# Altium project SPARTAN MINI HW2.0.PrjPcb
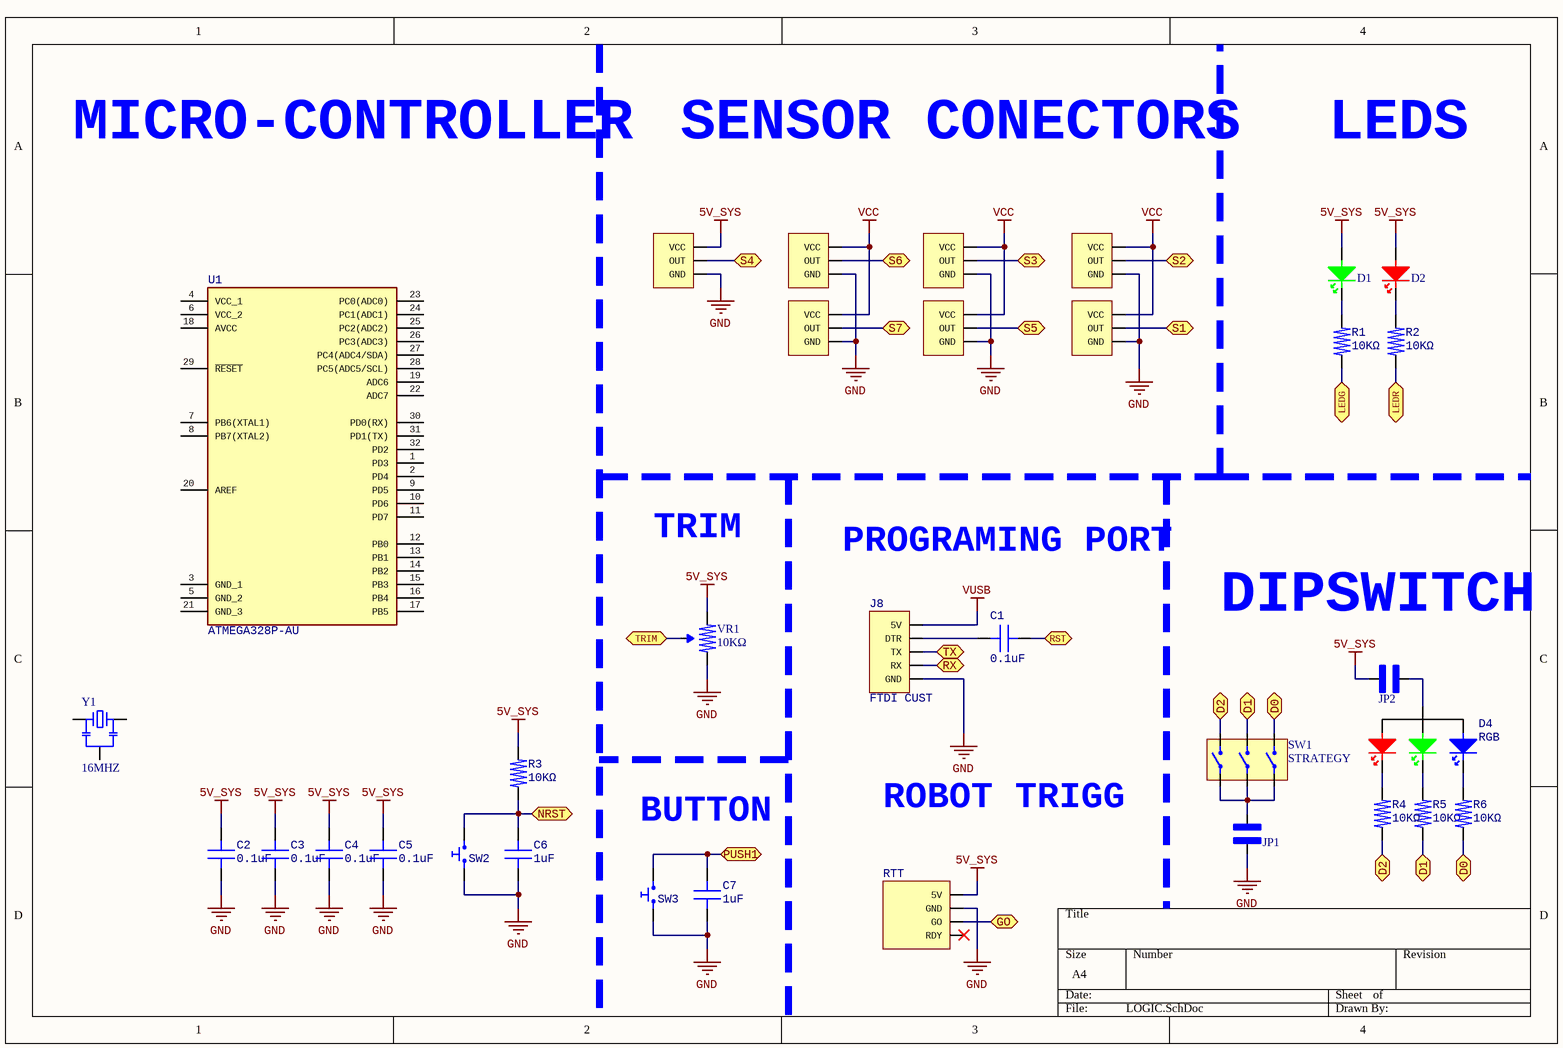
[diagram p0: LOGIC.SchDoc]
2 sheets, 77 parts. Net scope: flat (ports and power ports of the same name join across sheets).
Board file: SPARTAN MINI HW2.0 PCB.PcbDoc
Sheets:
  LOGIC.SchDoc
  POWER.SchDoc

## Sheet LOGIC.SchDoc
size A4; SheetNumber: 1; SheetTotal: 2

### Parts
C1  0.1uF  [CAP0603]
C2  0.1uF  [CAP0603]
C3  0.1uF  [CAP0603]
C4  0.1uF  [CAP0603]
C5  0.1uF  [CAP0603]
C6  1uF  [CAP0603]
C7  1uF  [CAP0603]
D1  G  [LED0603 GREEN]  (value not drawn)
D2  R  [LED0603 RED]  (value not drawn)
D4  RGB  [LED RGB FM-B2020RGBA-HG]
J1  GENERIC SENSOR 3X  [PINHEADER SENSOR CONNECTOR 3X]  (value not drawn)
J2  GENERIC SENSOR 3X  [PINHEADER SENSOR CONNECTOR 3X]  (value not drawn)
J3  GENERIC SENSOR 3X  [PINHEADER SENSOR CONNECTOR 3X]  (value not drawn)
J4  GENERIC SENSOR 3X  [PINHEADER SENSOR CONNECTOR 3X]  (value not drawn)
J5  GENERIC SENSOR 3X  [PINHEADER SENSOR CONNECTOR 3X]  (value not drawn)
J6  GENERIC SENSOR 3X  [PINHEADER SENSOR CONNECTOR 3X]  (value not drawn)
J7  GENERIC SENSOR 3X  [PINHEADER SENSOR CONNECTOR 3X]  (value not drawn)
J8  FTDI CUST  [UART PROG CONN]
J9  RTT  [ING. MAKER RTT]
JP1  ENABLE DPSW  [JUMPER 2 PADS]  (value not drawn)
JP2  ENABLE RGB  [JUMPER 2 PADS]  (value not drawn)
R1  10KΩ  [RES0603]
R2  10KΩ  [RES0603]
R3  10KΩ  [RES0603]
R4  10KΩ  [RES0603]
R5  10KΩ  [RES0603]
R6  10KΩ  [RES0603]
SW1  STRATEGY  [2193MSTR]
SW2  RESET  [PTS810SJK250SMTRLFS]  (value not drawn)
SW3  BUTTON1  [PTS810SJK250SMTRLFS]  (value not drawn)
U1  ATMEGA328P-AU  [TQFP-32]
VR1  10KΩ  [TC33X2503E]
Y1  16MHZ  [CSTCE16M0V53R0]

### Ports
D0 (bidir), D1 (bidir), D2 (bidir), GO (bidir), LEDG (bidir), LEDR (bidir), NRST (bidir), PUSH1 (bidir), RST (bidir), RX (bidir), S1 (bidir), S2 (bidir), S3 (bidir), S4 (bidir), S5 (bidir), S6 (bidir), S7 (bidir), TRIM (bidir), TX (bidir)

### Nets
5V_SYS: C2.2(A) C3.2(A) C4.2(A) C5.2(A) D1.2(A) D2.2(A) J1.2(VCC) J9.1(5V) JP2.C R3.2(A) VR1.3(CW)
GND: C2.1(K) C3.1(K) C4.1(K) C5.1(K) C6.1(K) C7.1(K) J1.4(GND) J2.4(GND) J3.4(GND) J4.4(GND) J5.4(GND) J6.4(GND) J7.4(GND) J8.GND J9.2(GND) JP1.C SW2.1(NO_1) SW3.1(NO_1) VR1.1(CCW)
VCC: J2.2(VCC) J3.2(VCC) J4.2(VCC) J5.2(VCC) J6.2(VCC) J7.2(VCC)
VUSB: J8.5V
NetC1_1: C1.1(K) ; port RST
NetC1_2: C1.2(A) J8.DTR
NetC6_2: C6.2(A) R3.1(K) SW2.2(NO_2) ; port NRST
NetC7_2: C7.2(A) SW3.2(NO_2) ; port PUSH1
NetD1_1: D1.1(K) R1.2(A)
NetD2_1: D2.1(K) R2.2(A)
NetD4_1: D4.1(K) R4.2(A)
NetD4_2: D4.2(K) R6.2(A)
NetD4_3: D4.3(COM) JP2.A
NetD4_4: D4.4(K) R5.2(A)
NetJ1_3: J1.3(OUT) ; port S4
NetJ2_3: J2.3(OUT) ; port S6
NetJ3_3: J3.3(OUT) ; port S2
NetJ4_3: J4.3(OUT) ; port S1
NetJ5_3: J5.3(OUT) ; port S5
NetJ6_3: J6.3(OUT) ; port S7
NetJ7_3: J7.3(OUT) ; port S3
NetJ8_RX: J8.RX ; port RX
NetJ8_TX: J8.TX ; port TX
NetJ9_3: J9.3(GO) ; port GO
NetJP1_A: JP1.A SW1.1(NO_1) SW1.2(NO_1) SW1.3(NO_1)
NetR1_1: R1.1(K) ; port LEDG
NetR2_1: R2.1(K) ; port LEDR
NetR4_1: R4.1(K) SW1.6(NO_2) ; port D2
NetR5_1: R5.1(K) SW1.5(NO_2) ; port D1
NetR6_1: R6.1(K) SW1.4(NO_2) ; port D0
NetVR1_2: VR1.2(WIPER) ; port TRIM

Not connected (* = marked no-connect by the designer): J9 4(RDY)*; U1 1(PD3) 2(PD4) 3(GND_1) 4(VCC_1) 5(GND_2) 6(VCC_2) 7(PB6(XTAL1)) 8(PB7(XTAL2)) 9(PD5) 10(PD6) 11(PD7) 12(PB0) 13(PB1) 14(PB2) 15(PB3) 16(PB4) 17(PB5) 18(AVCC) 19(ADC6) 20(AREF) 21(GND_3) 22(ADC7) 23(PC0(ADC0)) 24(PC1(ADC1)) 25(PC2(ADC2)) 26(PC3(ADC3)) 27(PC4(ADC4/SDA)) 28(PC5(ADC5/SCL)) 29(~{RESET}) 30(PD0(RX)) 31(PD1(TX)) 32(PD2); Y1 1 3 4

### Notes on the sheet
- MICRO-CONTROLLER
- SENSOR CONECTORS
- LEDS
- TRIM
- PROGRAMING PORT
- DIPSWITCH
- BUTTON
- ROBOT TRIGG

### Library data of the parts
C1-C5 = C0.1uF 25V X7R: Capacitor, Multilayer, Ceramic, 25V, 10%, X7R, 15% Tc, 0.1Uf, Surface Mount, 0603; Manufacturer: KEMET; Manufacturer Part Number: C0603C104K3RACTU; Material: 4241ConductorMaterial; Capacitance: 100nF; Dissipation Factor: 3.5%; Temperature Coefficient: 30ppm/°C; Supplier 1: Mouser; RoHS: Yes; Category: Ceramic Capacitors; Stock 1: 364631; Pricing 1: 1=0.19, 10=0.12, 50=0.12, 100=0.062, 1000=0.041, 10000=0.024 (USD); Mount: Surface Mount,PCB; Case/Package: 0603; Number of Pins: 2; Case Code (Metric): 1608; Case Code (Imperial): 0603; Dielectric Material: Ceramic; Min Operating Temperature: -55°C; Max Operating Temperature: 125°C; Dielectric: X7R; Package Quantity: 1; Voltage Rating: 25V; Tolerance: 10%; Packaging: Tape and Reel; Voltage Rating (DC): 25V; Termination: SMD/SMT; Voltage: 25V; Series: C; Construction: Flat; Length: 1.6mm; Width: 0.031inch; Height: 0.8mm; Thickness: 0.034inch; Lead Pitch: 0.7mm; Depth: 0.8mm; Radiation Hardening: No; Reach SVHC Compliant: No; RoHS Compliant: Yes; Lead Free: 5697LeadFree
C6 C7 = C1uF 50V X5R: Multilayer Ceramic Capacitor, 1 uF, 50 V, ï¿½ 10%, X5R, 0603 [1608 Metric]; Manufacturer: TDK; Manufacturer Part Number: C1608X5R1H105K080AB; Dielectric Material: 4241ConductorMaterial; Voltage Rating: 50V; Supplier 1: Mouser; RoHS: Yes; Category: Ceramic Capacitors; Stock 1: 142150; Pricing 1: 1=0.14, 10=0.078, 50=0.078, 100=0.05, 1000=0.035, 10000=0.023 (USD); Mount: Surface Mount; Case/Package: 0603; Number of Pins: 2; Case Code (Metric): 1608; Case Code (Imperial): 0603; Material: Ceramic; Min Operating Temperature: -55°C; Max Operating Temperature: 85°C; Capacitance: 1uF; Tolerance: 10%; Packaging: Tape and Reel; Package Quantity: 1; Dielectric: X5R; Voltage: 50V; Series: C; Construction: Flat; Length: 1.6mm; Width: 0.031inch; Height: 0.8mm; Thickness: 0.035inch; Depth: 0.8mm; Reach SVHC Compliant: No; Lead Free: Lead Free; RoHS Compliant: Yes
D1 = GREEN LED 0603: WURTH ELEKTRONIK - 150060VS75000 - LED, Green, SMD, 0603, 30 mA, 2 V, 570 nm; Manufacturer: Wurth Electronics; Lens Color: Colorless; Luminous Intensity: 40mcd; Viewing Angle: 140°; Forward Voltage: 2V; Lens Style: Rectangular,Flat; Forward Current: 20mA; Dominant Wavelength: 570nm; Lens Transparency: Clear; Power Rating: 72mW; Reverse Voltage (DC): 5V; Lens Size: 0.7mm; Supplier 1: Mouser; Manufacturer Part Number: 150060VS75000; RoHS: Yes; Category: LEDs; Stock 1: 15118; Pricing 1: 1=0.14, 10=0.14, 50=0.127, 100=0.109, 1000=0.101, 10000=0.101 (USD); Mount: Surface Mount; Case/Package: 0603; Number of Pins: 2; Color: Green; Case Code (Metric): 1608; Case Code (Imperial): 0603; Weight: 0.000882oz; Min Operating Temperature: -40°C; Max Operating Temperature: 85°C; Package Quantity: 4000; Packaging: Cut Tape; Test Current: 20mA; Illumination Color: Green; Series: WL-SMCW; Max Reverse Voltage (DC): 5V; Power Dissipation: 72mW; Reverse Voltage: 5V; Length: 1.6mm; Width: 0.8mm; Height: 0.8mm; RoHS Compliant: Yes; Reach SVHC Compliant: Unknown
D2 = RED LED 0603: Led, Red, 630 Nm, 1.9 V, 30 Ma, 60 Mcd Rohs Compliant: Yes |Wurth Elektronik 150060SS75000; Manufacturer: Wurth Electronics; Lens Color: Colorless; Luminous Intensity: 60mcd; Viewing Angle: 140°; Forward Voltage: 1.9V; Wavelength: 630nm; Lens Style: Clear,Flat,Rectangular; Forward Current: 30mA; Test Current: 20mA; Lens Transparency: Clear; Max Reverse Voltage (DC): 5V; Lens Size: 0.7mm; Supplier 1: Mouser; Manufacturer Part Number: 150060SS75000; RoHS: Yes; Category: LEDs; Stock 1: 8814; Pricing 1: 1=0.15, 10=0.15, 50=0.142, 100=0.122, 1000=0.116, 10000=0.116 (USD); Mount: Surface Mount; Case/Package: 0603; Color: Red; Case Code (Metric): 1608; Case Code (Imperial): 0603; Min Operating Temperature: -40°C; Max Operating Temperature: 85°C; Package Quantity: 1; Packaging: Cut Tape; Dominant Wavelength: 630nm; Series: WL-SMCW; Length: 1.6mm; Width: 0.8mm; Height: 0.8mm; RoHS Compliant: Yes; Reach SVHC Compliant: Unknown
D4 = RGB LED FM-B2020RGBA-HG: LED RGB
J1-J7 = GENERIC SENSOR 3X: PADS PARA CONECTAR UN SENSOR CON 1 LINEA DE VOLTAJE INDEPENDIENTE.
J8 = UART PROG: GENERIC UART PROGRAMING PORT FOR ARDUINO CUSTOM BOARDS
J9 = ING. MAKER RTT: CONECTOR PINHEADER PARA ARRANCADPR ING. MAKER
JP1 JP2 = SINGLE JUMPER NO: JUMPER SMD CON 2 PADS NORMALMENTE ABIERTO; pin to pad: A>2 C>1
R1 R2 R4-R6 = R1KΩ: SMD Chip Resistor, 1 kOhm, ï¿½ 1%, 100 mW, 0603 [1608 Metric], Thick Film, General Purpose; Manufacturer: Yageo; Manufacturer Part Number: RC0603FR-101KL; Resistance: 1kR; Temperature Coefficient: 100ppm/°C; Power Rating: 100mW; Voltage Rating: 50V; Supplier 1: Mouser; RoHS: Yes; Category: Chip SMD Resistors; Stock 1: 45082; Pricing 1: 1=0.1, 10=0.01, 50=0.01, 100=0.007, 1000=0.005, 10000=0.002 (USD); Case/Package: 0603; Number of Pins: 2; Contact Plating: Tin,Lead; Case Code (Imperial): 0603; Case Code (Metric): 1608; Min Operating Temperature: -55°C; Max Operating Temperature: 155°C; Tolerance: 1%; Resistor Type: Thick Film; Packaging: Tape and Reel; Termination: SMD/SMT; Voltage Rating (DC): 50V; Series: RC; Resistance Tolerance: 1%; Length: 1.6mm; Width: 0.8mm; Height: 0.45mm; RoHS Compliant: Yes; Reach SVHC Compliant: Unknown
R3 = R10KΩ: SMD Chip Resistor, 10 kOhm, ï¿½ 5%, 100 mW, 0603 [1608 Metric], Thick Film, General Purpose; Manufacturer: Yageo; Manufacturer Part Number: RC0603JR-0710KL; Resistance: 10kR; Temperature Coefficient: 100ppm/°C; Max Power Dissipation: 100mW; Voltage Rating (AC): 50V; Supplier 1: Mouser; RoHS: Yes; Category: Chip SMD Resistors; Stock 1: 1469517; Pricing 1: 1=0.1, 10=0.008, 50=0.008, 100=0.006, 1000=0.005, 10000=0.002 (USD); Case/Package: 0603; Min Operating Temperature: -55°C; Max Operating Temperature: 155°C; Tolerance: 5%; Number of Terminations: 2; Series: RC; Lead Free: Lead Free; Reach SVHC Compliant: Unknown; RoHS Compliant: Yes
SW1 = 219-3MST: Switch DIP ON OFF SPST 3 Raised Slide 0.1A 20VDC Gull Wing 2000Cycles 2.54mm SMD Tube; Manufacturer: CTS; Voltage Rating (DC): 20V; Number of Positions: 3; Actuator Type: Slide (Standard); Current Rating: 100mA; Washable: Yes; Supplier 1: Mouser; Manufacturer Part Number: 219-3MST; RoHS: Yes; Category: DIP Switches; Stock 1: 6563; Pricing 1: 1=0.68, 10=0.509, 50=0.509, 100=0.509, 1000=0.41, 10000=0.359 (USD); Mount: Surface Mount; Contact Material: Copper; Contact Plating: Gold,Tin; Mechanical Life: 2000Cycles; Min Operating Temperature: -55°C; Max Operating Temperature: 85°C; Packaging: Rail/Tube; Throw Configuration: SPST; Max Voltage Rating (DC): 20V; Electrical Life: 2000Cycles; Series: 219; Termination: Gull Wing; Package Quantity: 60; Max Current Rating: 100mA; Orientation: Straight; Length: 9.09mm; Terminal Pitch: 2.54mm; Depth: 9.91mm; Radiation Hardening: No; RoHS Compliant: Yes; Lead Free: Lead Free; Supplier 2: Mouser; Stock 2: 6563; Pricing 2: 1=0.68, 10=0.509, 50=0.509, 100=0.509, 1000=0.41, 10000=0.359 (USD)
SW2 SW3 = PTS810SJK250SMTR LFS: Switch Tactile N.O. SPST Button J-Bend 0.05A 16VDC 50000Cycle 2.55N SMD T/R; pin to pad: 1>1+2 2>3+4; Manufacturer: ITT C&K; Mechanical Life: 50000Cycles; Operating Force: 260gf; Current Rating: 50mA; Voltage Rating (DC): 16V; Illumination Type: Non-Illuminated; Switch Travel: 0.15mm; Switch Function: Off-Mom; Number of Positions: 2; Supplier 1: Mouser; Manufacturer Part Number: PTS810SJK250SMTRLFS; RoHS: Yes; Stock 1: 28271; Pricing 1: 1=0.58, 10=0.429, 50=0.429, 100=0.353, 1000=0.313, 10000=0.231 (USD); Mount: Surface Mount; Case/Package: SMD/SMT; Color: White; Contact Plating: Silver; Min Operating Temperature: -40°C; Max Operating Temperature: 85°C; Throw Configuration: SPST; Packaging: Tape and Reel; Package Quantity: 2900; Series: PTS810; Lead Free: Lead Free; RoHS Compliant: Yes
U1 = ATMEGA328P-AU: Risc Microcontroller, 8-BIT, Flash, AVR Risc Cpu, 20MHZ, Cmos, PQFP32; Manufacturer: Microchip; Interface: I2C,SPI,USART; RAM Size: 2KB; Max Supply Voltage: 5.5V; Min Supply Voltage: 1.8V; Number of I/Os: 23; Number of Timers/Counters: 3; Number of PWM Channels: 6; Oscillator Type: Internal; Data Bus Width: 8b; Number of SPI Channels: 1; Watchdog Timer: Yes; Memory Size: 32KB; Peripherals: Brown-out Detect/Reset,POR,PWM,WDT; Number of ADC Channels: 8; Supplier 1: Mouser; Supplier 2: Mouser; Manufacturer Part Number: ATMEGA328P-AU; RoHS: Yes; Category: Microcontrollers; Stock 2: 19185; Pricing 2: 1=2.66, 10=2.66, 50=2.44, 100=2.2, 1000=2.2, 10000=2.2 (USD); Mount: Surface Mount; Case/Package: A; Number of Pins: 32; Weight: 0.002469oz; Min Operating Temperature: -40°C; Max Operating Temperature: 85°C; Packaging: Tray; Number of Programmable I/O: 23; Max Frequency: 20MHz; Number of I2C Channels: 1; Memory Type: FLASH; Core Architecture: AVR; Series: ATmega328P; Package Quantity: 250; Frequency: 20MHz; Number of A/D Converters: 1; Length: 7mm; Width: 7mm; Height: 1mm; Radiation Hardening: No; Reach SVHC Compliant: Yes; Lead Free: Lead Free; RoHS Compliant: Yes
VR1 = 10KΩ: Cermet trimmer potentiometer, 10 kΩ, 0.1 W, SMD, on top, TC33X-2-103E; Manufacturer: Bourns; Tolerance: 25%; Resistance: 10kR; Power Rating: 100mW; Number of Turns: 1; Temperature Coefficient: 250ppm/°C; Voltage Rating (DC): 50V; Supplier 1: Mouser; Manufacturer Part Number: TC33X-2-103E; RoHS: Yes; Category: Variable Resistors and Potentiometers; Stock 1: 61518; Pricing 1: 1=0.32, 10=0.23, 50=0.23, 100=0.197, 1000=0.173, 10000=0.12 (USD); Mount: Surface Mount; Color: Silver; Weight: 29.4mg; Min Operating Temperature: -40°C; Max Operating Temperature: 100°C; Packaging: Tape and Reel; Package Quantity: 1; Resistor Type: Cermet; Termination: Foot Print; Taper: Linear; Max Power Dissipation: 100mW; Series: TC33; Resistance Tolerance: 25%; Length: 3mm; Width: 0.118inch; Height: 0.047inch; Depth: 3.8mm; Radiation Hardening: No; Reach SVHC Compliant: No; Military Standard: Not; Lead Free: Lead Free; RoHS Compliant: Yes
Y1 = RESONATOR 16MHZ CSTCE16M0V53-R0: pin to pad: 4>2

## Sheet POWER.SchDoc
size A4; SheetNumber: 2; SheetTotal: 2
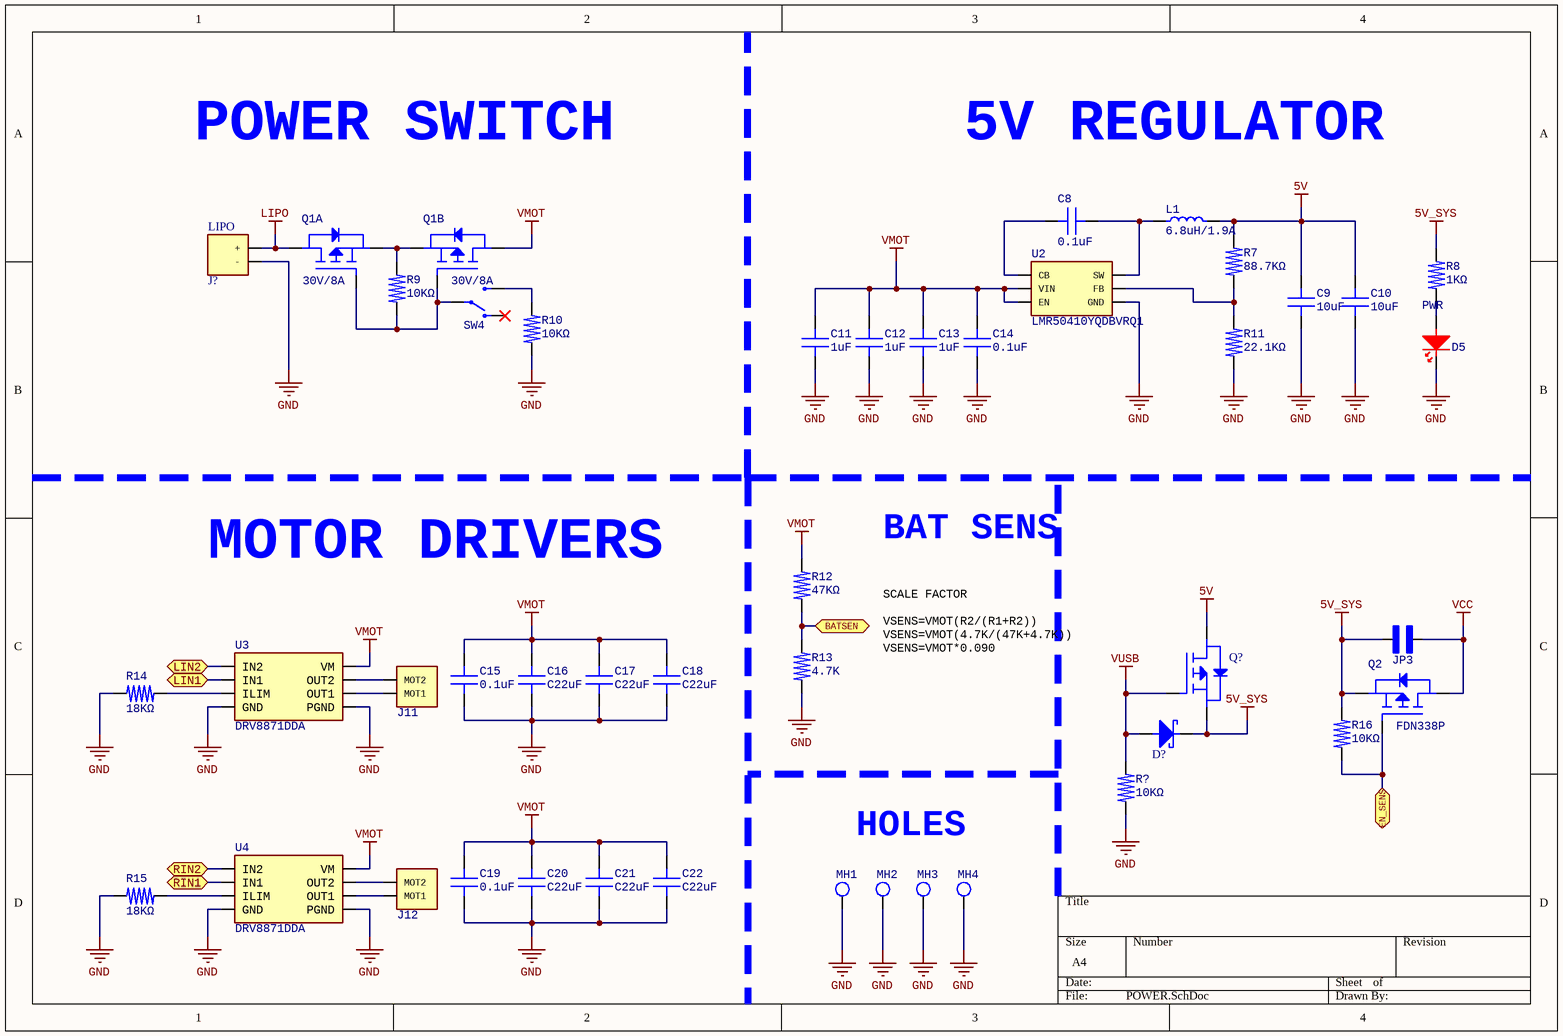
[diagram p1: POWER.SchDoc]

### Parts
C8  0.1uF  [CAP0603]
C9  10uF  [CAP0603]
C10  10uF  [CAP0603]
C11  1uF  [CAP0603]
C12  1uF  [CAP0603]
C13  1uF  [CAP0603]
C14  0.1uF  [CAP0603]
C15  0.1uF  [CAP0603]
C16  C22uF  [CAP0805]
C17  C22uF  [CAP0805]
C18  C22uF  [CAP0805]
C19  0.1uF  [CAP0603]
C20  C22uF  [CAP0805]
C21  C22uF  [CAP0805]
C22  C22uF  [CAP0805]
D5  PWR  [LED0603 RED]
D?  MBR120LSFT1  [SOD-123]  (value not drawn)
J11  MOTOR CONN SMALL  [MOTOR CONN SMALL]  (value not drawn)
J12  MOTOR CONN SMALL  [MOTOR CONN SMALL]  (value not drawn)
J?  LIPO  [BATTERY CONNECTOR SMALL]
JP3  ENSENS  [JUMPER 2 PADS]  (value not drawn)
L1  6.8uH/1.9A  [INDUCTOR 4mm x 4mm x 2mm]
MH1  HOLE 3.1mm  [HOLE 3.1mm]  (value not drawn)
MH2  HOLE 3.1mm  [HOLE 3.1mm]  (value not drawn)
MH3  HOLE 3.1mm  [HOLE 3.1mm]  (value not drawn)
MH4  HOLE 3.1mm  [HOLE 3.1mm]  (value not drawn)
Q1  30V/8A  [SOIC-8]  (parts A,B of 2)
Q2  FDN338P  [SOT-25-3]
Q?  FDN338P  [SOT-25-3]  (value not drawn)
R7  88.7KΩ  [RES0603]
R8  1KΩ  [RES0603]
R9  10KΩ  [RES0603]
R10  10KΩ  [RES0603]
R11  22.1KΩ  [RES0603]
R12  47KΩ  [RES0603]
R13  4.7K  [RES0603]
R14  18KΩ  [RES0603]
R15  18KΩ  [RES0603]
R16  10KΩ  [RES0603]
R?  10KΩ  [RES0603]
SW4  OFF/ON  [SS12D00]  (value not drawn)
U2  LMR50410YQDBVRQ1  [SOT23-6]
U3  DRV8871DDA  [HSOP8 EP]
U4  DRV8871DDA  [HSOP8 EP]

### Ports
BATSEN (bidir), EN_SENS (bidir), LIN1 (bidir), LIN2 (bidir), RIN1 (bidir), RIN2 (bidir)

### Nets
5V: C9.2(A) C10.2(A) L1.2(A) Q?.D R7.2(A)
5V_SYS: D?.1(K) JP3.C Q2.S Q?.S R8.2(A) R16.1(K)
GND: C9.1(K) C10.1(K) C11.1(K) C12.1(K) C13.1(K) C14.1(K) C15.1(K) C16.1(K) C17.1(K) C18.1(K) C19.1(K) C20.1(K) C21.1(K) C22.1(K) D5.1(K) J?.2(-) MH1.1(HOLE) MH2.1(HOLE) MH3.1(HOLE) MH4.1(HOLE) R10.2(A) R11.1(K) R13.2(A) R14.1(K) R15.1(K) R?.2(A) U2.2(GND) U3.1(GND) U3.7(PGND) U4.1(GND) U4.7(PGND)
LIPO: J?.1(+) Q1.D_A
VCC: JP3.A Q2.D
VMOT: C11.2(A) C12.2(A) C13.2(A) C14.2(A) C15.2(A) C16.2(A) C17.2(A) C18.2(A) C19.2(A) C20.2(A) C21.2(A) C22.2(A) Q1.D_B R12.1(K) U2.4(EN) U2.5(VIN) U3.5(VM) U4.5(VM)
VUSB: D?.2(A) Q?.G R?.1(K)
NetC8_1: C8.1(K) U2.1(CB)
NetC8_2: C8.2(A) L1.1(K) U2.6(SW)
NetD5_2: D5.2(A) R8.1(K)
NetJ11_1: J11.1(MOT1) U3.6(OUT1)
NetJ11_2: J11.2(MOT2) U3.8(OUT2)
NetJ12_1: J12.1(MOT1) U4.6(OUT1)
NetJ12_2: J12.2(MOT2) U4.8(OUT2)
NetQ1_G_A: Q1.G_A Q1.G_B R9.1(K) SW4.COM
NetQ1_S_A: Q1.S_A Q1.S_B R9.2(A)
NetQ2_G: Q2.G R16.2(A) ; port EN_SENS
NetR7_1: R7.1(K) R11.2(A) U2.3(FB)
NetR10_1: R10.1(K) SW4.NC
NetR12_2: R12.2(A) R13.1(K) ; port BATSEN
NetR14_2: R14.2(A) U3.4(ILIM)
NetR15_2: R15.2(A) U4.4(ILIM)
NetU3_2: U3.2(IN2) ; port LIN2
NetU3_3: U3.3(IN1) ; port LIN1
NetU4_2: U4.2(IN2) ; port RIN2
NetU4_3: U4.3(IN1) ; port RIN1

Not connected (* = marked no-connect by the designer): SW4 NO*

### Notes on the sheet
- POWER SWITCH
- 5V REGULATOR
- MOTOR DRIVERS
- BAT SENS
- SCALE FACTOR
  VSENS=VMOT(R2/(R1+R2))
  VSENS=VMOT(4.7K/(47K+4.7K))
  VSENS=VMOT*0.090
- HOLES

### Library data of the parts
C8 C14 = C0.1uF 50V X7R: Multilayer Ceramic Capacitor, 0.1 uF, 50 V, ï¿½ 10%, X7R, 0603 [1608 Metric]; Manufacturer: Murata; Manufacturer Part Number: GCM188R71H104KA57J; Capacitance: 100nF; Voltage Rating: 50V; Supplier 1: Mouser; RoHS: Yes; Category: Ceramic Capacitors; Stock 1: 536618; Pricing 1: 1=0.18, 10=0.076, 50=0.076, 100=0.051, 1000=0.046, 10000=0.037 (USD); Mount: Surface Mount; Case/Package: 0603; Case Code (Metric): 1608; Case Code (Imperial): 0603; Material: Ceramic; Min Operating Temperature: -55°C; Max Operating Temperature: 125°C; Package Quantity: 1; Packaging: Tape and Reel; Tolerance: 10%; Voltage Rating (DC): 50V; Dielectric: X7R; Termination: SMD/SMT; Series: GCM; Construction: Flat; Length: 1.6mm; Width: 0.031inch; Height: 0.8mm; Thickness: 0.035inch; Depth: 0.8mm; Ratings: AEC-Q200; Radiation Hardening: No; Lead Free: Lead Free; RoHS Compliant: Yes
C9 C10 = C10uF 10uF X5R: Multilayer Ceramic Capacitor, 10 uF, 10 V, ï¿½ 20%, X5R, 0603 [1608 Metric]; Manufacturer: Murata; Manufacturer Part Number: GRM188R61A106ME69D; Voltage Rating: 10V; Supplier 1: Mouser; RoHS: Yes; Category: Ceramic Capacitors; Stock 1: 58993; Pricing 1: 1=0.13, 10=0.078, 50=0.078, 100=0.044, 1000=0.03, 10000=0.02 (USD); Mount: Surface Mount; Case/Package: 0603; Number of Pins: 2NUMBER; Case Code (Metric): 1608; Case Code (Imperial): 0603; Material: Ceramic; Weight: 0.000222oz; Min Operating Temperature: -55°C; Max Operating Temperature: 85°C; Packaging: Tape and Reel; Tolerance: 20%; Capacitance: 10uF; Dielectric: X5R; Termination: SMD/SMT; Voltage Rating (DC): 10V; Package Quantity: 4000; Series: GRM; Length: 1.6mm; Width: 0.8mm; Height: 0.8mm; Thickness: 0.035inch; Lead Free: Lead Free; RoHS Compliant: Yes; Reach SVHC Compliant: Unknown; ComponentLink7URL: http://www.farnell.com/datasheets/1872210.pdf?src-supplier=Newark; ComponentLink7Description: http://www.farnell.com/datasheets/1872210.pdf?src-supplier=Newark; ComponentLink8URL: https://datasheet.octopart.com/GRM188R61A106ME69D-Murata-datasheet-165579666.pdf?src-supplier=TME; ComponentLink8Description: https://datasheet.octopart.com/GRM188R61A106ME69D-Murata-datasheet-165579666.pdf?src-supplier=TME
C11-C13 = C1uF 50V X5R: as C6 on sheet LOGIC; Supplier 1: Mouser; RoHS: Yes; Category: Ceramic Capacitors; Stock 1: 142150; Pricing 1: 1=0.14, 10=0.078, 50=0.078, 100=0.05, 1000=0.035, 10000=0.023 (USD); Mount: Surface Mount; Case/Package: 0603; Number of Pins: 2; Case Code (Metric): 1608; Case Code (Imperial): 0603; Material: Ceramic; Min Operating Temperature: -55°C; Max Operating Temperature: 85°C; Capacitance: 1uF; Tolerance: 10%; Packaging: Tape and Reel; Package Quantity: 1; Dielectric: X5R; Voltage: 50V; Series: C; Construction: Flat; Length: 1.6mm; Width: 0.031inch; Height: 0.8mm; Thickness: 0.035inch; Depth: 0.8mm; Reach SVHC Compliant: No; Lead Free: Lead Free; RoHS Compliant: Yes
C15 C19 = C0.1uF 25V X7R: as C1 on sheet LOGIC; Supplier 1: Mouser; RoHS: Yes; Category: Ceramic Capacitors; Stock 1: 364631; Pricing 1: 1=0.19, 10=0.12, 50=0.12, 100=0.062, 1000=0.041, 10000=0.024 (USD); Mount: Surface Mount,PCB; Case/Package: 0603; Number of Pins: 2; Case Code (Metric): 1608; Case Code (Imperial): 0603; Dielectric Material: Ceramic; Min Operating Temperature: -55°C; Max Operating Temperature: 125°C; Dielectric: X7R; Package Quantity: 1; Voltage Rating: 25V; Tolerance: 10%; Packaging: Tape and Reel; Voltage Rating (DC): 25V; Termination: SMD/SMT; Voltage: 25V; Series: C; Construction: Flat; Length: 1.6mm; Width: 0.031inch; Height: 0.8mm; Thickness: 0.034inch; Lead Pitch: 0.7mm; Depth: 0.8mm; Radiation Hardening: No; Reach SVHC Compliant: No; RoHS Compliant: Yes; Lead Free: 5697LeadFree
C16-C18 C20-C22 = C22uF 25V X5R: Cap, 22Uf, 25V, Mlcc, 0805 Rohs Compliant: Yes |Murata GRM21BR61E226ME44K; Manufacturer: Murata; Material: Ceramic; Tolerance: 20%; Dielectric: X5R; Supplier 1: Mouser; Manufacturer Part Number: GRM21BR61E226ME44K; RoHS: Yes; Category: Ceramic Capacitors; Stock 1: 137577; Pricing 1: 1=0.39, 10=0.168, 50=0.168, 100=0.114, 1000=0.099, 10000=0.07 (USD); Mount: Surface Mount; Case/Package: 0805; Case Code (Imperial): 0805; Case Code (Metric): 2012; Weight: 0.000335oz; Min Operating Temperature: -55°C; Max Operating Temperature: 85°C; Packaging: Tape and Reel; Capacitance: 22uF; Voltage Rating: 25V; Termination: SMD/SMT; Voltage Rating (DC): 25V; Package Quantity: 10000; Series: GRM; Length: 0.079inch; Width: 1.25mm; Height: 1.25mm; Thickness: 0.057inch; RoHS Compliant: Yes
D5 = RED LED 0603: as D2 on sheet LOGIC; Supplier 1: Mouser; Manufacturer Part Number: 150060SS75000; RoHS: Yes; Category: LEDs; Stock 1: 8814; Pricing 1: 1=0.15, 10=0.15, 50=0.142, 100=0.122, 1000=0.116, 10000=0.116 (USD); Mount: Surface Mount; Case/Package: 0603; Color: Red; Case Code (Metric): 1608; Case Code (Imperial): 0603; Min Operating Temperature: -40°C; Max Operating Temperature: 85°C; Package Quantity: 1; Packaging: Cut Tape; Dominant Wavelength: 630nm; Series: WL-SMCW; Length: 1.6mm; Width: 0.8mm; Height: 0.8mm; RoHS Compliant: Yes; Reach SVHC Compliant: Unknown
D? = MBR120LSFT1: Manufacturer Part Number: MBR120LSFT1G; Manufacturer Lifecycle Status: ACTIVE; Manufacturer 1: onsemi; Average Rectified Current: 1A; Element Configuration: Single; Forward Voltage: 260mV; Max Forward Surge Current (Ifsm): 50A; Max Repetitive Reverse Voltage (Vrrm): 20V; Max Reverse Leakage Current: 400µA; Number of Elements: 1; Polarity: Standard; Description 1: Rectifier Diode Schottky Si 20V 1A 2-Pin SOD-123FL T/R / DIODE SCHOTTKY 20V 1A SOD123L; Supplier 1: Mouser; Supplier Part Number 1: 863-MBR120LSFT1G; RoHS: Compliant; Category: Schottky Diodes; Stock: 5212; Pricing: 1=0.59, 10=0.364, 50=0.364, 100=0.232, 1000=0.156, 10000=0.104 (USD); Case/Package: SOD; China RoHS: Non-Compliant; Contact Plating: Tin; Country of Origin: Malaysia; Current Rating: 1A; Export Control Classification Number (ECCN) Code: EAR99; Forward Current: 1A; Halogen Free: Halogen Free; Height: 880µm; Harmonized Tariff Schedule (HTS) Code: 8541.10.00.80; Introduction Date: 2002-10-09; Lead Free: Lead Free; Length: 2.9mm; Lifecycle Status: Production; Max Operating Temperature: 125°C; Max Output Current: 1A; Max Reverse Voltage (DC): 20V; Max Surge Current: 50A; Min Operating Temperature: -55°C; Number of Pins: 2; Number of Terminals: 2; Output Current: 1A; Packaging: Tape and Reel; Peak Non-Repetitive Surge Current: 50A; Peak Reverse Current: 400µA; Radiation Hardening: No; REACH SVHC: No; Reverse Standoff Voltage: 20V; Schedule B: 8541100080; Voltage Rating (DC): 20V; Width: 1.8mm; ComponentLink1URL: https://datasheet.octopart.com:443/MBR120LSFT1G-ON-Semiconductor-datasheet-37114088.pdf?src-supplier=Newark; ComponentLink1Description: https://datasheet.octopart.com:443/MBR120LSFT1G-ON-Semiconductor-datasheet-37114088.pdf?src-supplier=Newark; ComponentLink2URL: https://datasheet.octopart.com:443/MBR120LSFT1G-onsemi-datasheet-181959027.pdf?src-supplier=Newark; ComponentLink2Description: https://datasheet.octopart.com:443/MBR120LSFT1G-onsemi-datasheet-181959027.pdf?src-supplier=Newark; ComponentLink3URL: https://datasheet.octopart.com:443/MBR120LSFT1G-onsemi-datasheet-180961601.pdf?src-supplier=IHS; ComponentLink3Description: https://datasheet.octopart.com:443/MBR120LSFT1G-onsemi-datasheet-180961601.pdf?src-supplier=IHS; ComponentLink4URL: https://datasheet.octopart.com:443/MBR120LSFT1G-ON-Semiconductor-datasheet-11730539.pdf?src-supplier=onsemi; ComponentLink4Description: https://datasheet.octopart.com:443/MBR120LSFT1G-ON-Semiconductor-datasheet-11730539.pdf?src-supplier=onsemi; ComponentLink5URL: https://datasheet.octopart.com:443/MBR120LSFT1G-onsemi-datasheet-189129223.pdf?src-supplier=Master+Electronics; ComponentLink5Description: https://datasheet.octopart.com:443/MBR120LSFT1G-onsemi-datasheet-189129223.pdf?src-supplier=Master+Electronics; ComponentLink6URL: https://datasheet.octopart.com:443/MBR120LSFT1G-ON-Semiconductor-datasheet-14054996.pdf?src-supplier=iiiC; ComponentLink6Description: https://datasheet.octopart.com:443/MBR120LSFT1G-ON-Semiconductor-datasheet-14054996.pdf?src-supplier=iiiC; ComponentLink7URL: https://datasheet.octopart.com:443/MBR120LSFT1G-ON-Semiconductor-datasheet-9696420.pdf?src-supplier=RS+(Formerly+Allied+Electronics); ComponentLink7Description: https://datasheet.octopart.com:443/MBR120LSFT1G-ON-Semiconductor-datasheet-9696420.pdf?src-supplier=RS+(Formerly+Allied+Electronics); ComponentLink8URL: https://datasheet.octopart.com:443/MBR120LSFT1G-ON-Semiconductor-datasheet-7627526.pdf?src-supplier=Farnell; ComponentLink8Description: https://datasheet.octopart.com:443/MBR120LSFT1G-ON-Semiconductor-datasheet-7627526.pdf?src-supplier=Farnell; ComponentLink9URL: http://sigma.octopart.com:80/15540786/rohs_certificate/ON-Semiconductor-MBR120LSFT1G.pdf?src-supplier=Compliance+Statements; ComponentLink9Description: http://sigma.octopart.com:80/15540786/rohs_certificate/ON-Semiconductor-MBR120LSFT1G.pdf?src-supplier=Compliance+Statements; ComponentLink10URL: http://sigma.octopart.com:80/15677548/materials_sheet/ON-Semiconductor-MBR120LSFT1G.csv?src-supplier=Compliance+Statements; ComponentLink10Description: http://sigma.octopart.com:80/15677548/materials_sheet/ON-Semiconductor-MBR120LSFT1G.csv?src-supplier=Compliance+Statements; ComponentLink11URL: http://sigma.octopart.com:80/150613994/rohs_statement/ON-Semiconductor-MBR120LSFT1G.pdf?src-supplier=Compliance+Statements; ComponentLink11Description: http://sigma.octopart.com:80/150613994/rohs_statement/ON-Semiconductor-MBR120LSFT1G.pdf?src-supplier=Compliance+Statements; ComponentLink12URL: http://sigma.octopart.com:80/reach_statement/ON-Semiconductor-company-79.pdf?src-supplier=Compliance+Statements; ComponentLink12Description: http://sigma.octopart.com:80/reach_statement/ON-Semiconductor-company-79.pdf?src-supplier=Compliance+Statements; ComponentLink13URL: https://octopart.com:443/opatz8j6/c1?t=2ICm1KeR9lqrV-9whfkRA44D3hFx6PDn5_A0MNxFaUdO4o5v_qbxEQPqTntcuO9N9I3hBniUpCqfMINp71cVvkdTpURQmko4dTX9rqde5Cf3VpgdAg3K1o248i4HBmP2_Tqq0p1F2ZkX7mjILE2AnxaiCcHqPARINWibdNJrEXxGnKJ2LOOWxijYCJAy5qO9kqDGptRk1NR4nN1jM9RzpulMHVN6BX3o5gIy6SSuhGuPyfLXACdfid-I2n-Y79NBPAbqEzQ3NwqY6QVlWxJCXx6kK7Q54A-YGddcguNVCHVmu2SuXJWcng26o0vyuol0iwIubwc4zHmzf-HtHLnuieEvTO6SMEg9_DpQOA&src-supplier=Compliance+Statements; ComponentLink13Description: https://octopart.com:443/opatz8j6/c1?t=2ICm1KeR9lqrV-9whfkRA44D3hFx6PDn5_A0MNxFaUdO4o5v_qbxEQPqTntcuO9N9I3hBniUpCqfMINp71cVvkdTpURQmko4dTX9rqde5Cf3VpgdAg3K1o248i4HBmP2_Tqq0p1F2ZkX7mjILE2AnxaiCcHqPARINWibdNJrEXxGnKJ2LOOWxijYCJAy5qO9kqDGptRk1NR4nN1jM9RzpulMHVN6BX3o5gIy6SSuhGuPyfLXACdfid-I2n-Y79NBPAbqEzQ3NwqY6QVlWxJCXx6kK7Q54A-YGddcguNVCHVmu2SuXJWcng26o0vyuol0iwIubwc4zHmzf-HtHLnuieEvTO6SMEg9_DpQOA&src-supplier=Compliance+Statements; ComponentLink14URL: https://octopart.com:443/opatz8j6/c1?t=zeIKbDt2eKZzl5z0s2d0QXLtLt33CcwbWtIpUrrxX6AQ_NOZh8tXX2U6z3WNFk5ZgTTYPjrCGpkSHdRB9hEcX87d4aeyW43j9K4kV5xXxBI5dhp4Lp7JiTCGRllsIHUnkxjzaeeOuBUZnKdin1SUBQLJjMUCP331XZ_QTEPzaJ02iVbVtCio5r30wRQ6LXHyGXZLbm5qxXfvPbzngscoaQnjezbRah5IcHlnvDuzP48aZQf0lCBqBb6eZNAZu8QrR18-Tx1o75ATaRdDtsuZ1RvJ9-ZJ7qCUmOCGYE99BFGUz1ssMVvNlkohtdnTs6H-XEVN_lX6IKEVYNHLhYTSqeOaaX24JdcNZXKJ5Gs&src-supplier=Compliance+Statements; ComponentLink14Description: https://octopart.com:443/opatz8j6/c1?t=zeIKbDt2eKZzl5z0s2d0QXLtLt33CcwbWtIpUrrxX6AQ_NOZh8tXX2U6z3WNFk5ZgTTYPjrCGpkSHdRB9hEcX87d4aeyW43j9K4kV5xXxBI5dhp4Lp7JiTCGRllsIHUnkxjzaeeOuBUZnKdin1SUBQLJjMUCP331XZ_QTEPzaJ02iVbVtCio5r30wRQ6LXHyGXZLbm5qxXfvPbzngscoaQnjezbRah5IcHlnvDuzP48aZQf0lCBqBb6eZNAZu8QrR18-Tx1o75ATaRdDtsuZ1RvJ9-ZJ7qCUmOCGYE99BFGUz1ssMVvNlkohtdnTs6H-XEVN_lX6IKEVYNHLhYTSqeOaaX24JdcNZXKJ5Gs&src-supplier=Compliance+Statements
J11 J12 = MOTOR CONN SMALL: CONECTOR PARA MOTORES, ESPACIADO DE 2.54MM
J? = BATT CONN SMALL: CONECTOR PARA BATERIA, ESPACIADO DE 2.54MM
JP3 = SINGLE JUMPER NO: JUMPER SMD CON 2 PADS NORMALMENTE ABIERTO; pin to pad: A>2 C>1
L1 = INDUCTOR 6.8uH/1.9A 74405042068: Power Inductors - SMD WE-LQSH 6.8uH 1.9A DCR=156mOhms AECQ200 4mm X 4mm X 2mm; Manufacturer 1: Wurth Elektronik; DC Resistance (DCR): 130mΩ; Inductance: 6.8µH; Inductance Tolerance: 20%; Description 1: WE-LQSH SMT Semi-Shielded Power Inductor; Supplier 1: Mouser; Supplier Part Number 1: 710-74405042068; Manufacturer Part Number: 74405042068; RoHS: Compliant; Category: Fixed Inductors; Stock: 850; Pricing: 1=0.79, 10=0.785, 50=0.654, 100=0.496, 1000=0.432, 10000=0.418 (USD); Ambient Temperature Range High: 85°C; Ambient Temperature Range Low: -40°C; Current Rating: 1.9A; Height: 2mm; Length: 4mm; Max Operating Temperature: 120°C; Min Operating Temperature: -40°C; Width: 4mm; ComponentLink1URL: https://datasheet.octopart.com:443/74405042068-Wurth-Elektronik-datasheet-168488400.pdf?src-supplier=Newark; ComponentLink1Description: https://datasheet.octopart.com:443/74405042068-Wurth-Elektronik-datasheet-168488400.pdf?src-supplier=Newark; ComponentLink2URL: https://datasheet.octopart.com:443/74405042068-W%C3%BCrth-Elektronik-datasheet-82513422.pdf?src-supplier=Farnell; ComponentLink2Description: https://datasheet.octopart.com:443/74405042068-W%C3%BCrth-Elektronik-datasheet-82513422.pdf?src-supplier=Farnell
MH1-MH4 = HOLE 3.1mm: MOUNTING HOLE 3.1mm; pin to pad: 1>13
Q1 = PMOS MCQ7328-TP: DUAL P MOSFET MCQ7328-TP; pin to pad: D_A>7+8 D_B>5+6 G_A>2 G_B>4 S_A>1 S_B>3; Manufacturer Part Number: DMP4025LSD-13; Manufacturer 1: Diodes Inc.; Continuous Drain Current (ID): 5.8A; Drain to Source Breakdown Voltage: -40V; Drain to Source Resistance: 45mΩ; Drain to Source Voltage (Vdss): 40V; Fall Time: 30.9ns; Gate to Source Voltage (Vgs): 20V; Input Capacitance: 1.64nF; Max Power Dissipation: 1.8W; Number of Channels: 2; Rds On Max: 25mΩ; Rise Time: 14.7ns; Threshold Voltage: -1.3V; Turn-Off Delay Time: 53.7ns; Turn-On Delay Time: 6.9ns; Description 1: Transistor MOSFET Array Dual P-CH 40V 7.6A 8-Pin SOIC T/R; Supplier 1: Mouser; Supplier Part Number 1: 621-DMP4025LSD-13; RoHS: Compliant; Category: MOSFETs; Stock: 7458; Pricing: 1=1.25, 10=0.865, 50=0.865, 100=0.497, 1000=0.386, 10000=0.312 (USD); Case/Package: SOIC; China RoHS: Compliant; Country of Origin: Mainland China; Export Control Classification Number (ECCN) Code: EAR99; Height: 1.5mm; Introduction Date: 2012-06-27; Lead Free: Lead Free; Length: 4.95mm; Lifecycle Status: NRND; Max Operating Temperature: 150°C; Min Breakdown Voltage: 40V; Min Operating Temperature: -55°C; Mount: Surface Mount; Number of Elements: 2; Number of Pins: 8; Number of Terminals: 8; Power Dissipation: 1.8W; REACH SVHC: Yes; Schedule B: 8541290080, 8541290080|8541290080|8541290080|8541290080|8541290080; Weight: 73.992255mg; Width: 3.95mm
Q2 Q? = FDN338P: PMOS 20VDS 2.8A; pin to pad: D>3 G>1 S>2; Manufacturer Lifecycle Status: ACTIVE; Manufacturer 1: onsemi; Continuous Drain Current (ID): 1.6A; Current Rating: -1.6A; Drain to Source Breakdown Voltage: -20V; Drain to Source Resistance: 115mΩ; Element Configuration: Single; Fall Time: 11ns; Gate to Source Voltage (Vgs): 8V; Input Capacitance: 451pF; Max Junction Temperature (Tj): 150°C; Max Power Dissipation: 500mW; Min Breakdown Voltage: 20V; Nominal Vgs: -800mV; Number of Channels: 1; Turn-Off Delay Time: 16ns; Turn-On Delay Time: 10ns; Description 1: P-Channel PowerTrench® MOSFET, 2.5V Specified, -20V, -1.6A, 115mΩ; Supplier 1: Mouser; Supplier Part Number 1: 512-FDN338P; Manufacturer Part Number: FDN338P; RoHS: Compliant; Category: MOSFETs; Stock: 1459; Pricing: 1=1.24, 10=0.857, 50=0.857, 100=0.542, 1000=0.248, 10000=0.22 (USD); Case/Package: TO-236-3; China RoHS: Compliant; Contact Plating: Tin; Country of Origin: Philippines; Drain to Source Voltage (Vdss): -20V; Export Control Classification Number (ECCN) Code: EAR99; Height: 1.22mm; Harmonized Tariff Schedule (HTS) Code: 8541.21.00.95; Introduction Date: 1997-06-01; Lead Free: Lead Free; Lifecycle Status: Production; Max Operating Temperature: 150°C; Min Operating Temperature: -55°C; Mount: Surface Mount; Number of Elements: 1; Number of Pins: 3; Number of Terminals: 3; Packaging: Cut Tape; Power Dissipation: 500mW; Radiation Hardening: No; Rds On Max: 115mΩ; REACH SVHC: Yes; Resistance: 115mΩ; Rise Time: 11ns; Threshold Voltage: -800mV; Voltage Rating (DC): -20V; Weight: 30mg; Width: 3.05mm
R7 = R88.7KΩ: SMD Chip Resistor, 88.7 kOhm, ï¿½ 1%, 100 mW, 0603 [1608 Metric], Thick Film, General Purpose; Manufacturer: Yageo; Manufacturer Part Number: RC0603FR-0788K7L; Power Rating: 100mW; Resistance: 88.7kR; Voltage Rating: 50V; Temperature Coefficient: 100ppm/°C; Supplier 1: Mouser; RoHS: Yes; Category: Chip SMD Resistors; Stock 1: 16669; Pricing 1: 1=0.1, 10=0.009, 50=0.009, 100=0.006, 1000=0.005, 10000=0.002 (USD); Case/Package: 0603; Case Code (Imperial): 0603; Case Code (Metric): 1608; Contact Plating: Tin,Matte; Size Code: 0603; Min Operating Temperature: -55°C; Max Operating Temperature: 155°C; Tolerance: 1%; Packaging: Tape and Reel; Package Quantity: 1; Termination: SMD/SMT; Number of Terminations: 2; Max Power Dissipation: 100mW; Voltage Rating (DC): 50V; Features: Moisture Resistant; Series: RC; Length: 0.063inch; Width: 0.031inch; Height: 0.022inch; Lead Free: Lead Free; RoHS Compliant: Yes
R8 = R1KΩ: as R1 on sheet LOGIC; Supplier 1: Mouser; RoHS: Yes; Category: Chip SMD Resistors; Stock 1: 45082; Pricing 1: 1=0.1, 10=0.01, 50=0.01, 100=0.007, 1000=0.005, 10000=0.002 (USD); Case/Package: 0603; Number of Pins: 2; Contact Plating: Tin,Lead; Case Code (Imperial): 0603; Case Code (Metric): 1608; Min Operating Temperature: -55°C; Max Operating Temperature: 155°C; Tolerance: 1%; Resistor Type: Thick Film; Packaging: Tape and Reel; Termination: SMD/SMT; Voltage Rating (DC): 50V; Series: RC; Resistance Tolerance: 1%; Length: 1.6mm; Width: 0.8mm; Height: 0.45mm; RoHS Compliant: Yes; Reach SVHC Compliant: Unknown
R9 R10 R16 R? = R10KΩ: as R3 on sheet LOGIC; Supplier 1: Mouser; RoHS: Yes; Category: Chip SMD Resistors; Stock 1: 1469517; Pricing 1: 1=0.1, 10=0.008, 50=0.008, 100=0.006, 1000=0.005, 10000=0.002 (USD); Case/Package: 0603; Min Operating Temperature: -55°C; Max Operating Temperature: 155°C; Tolerance: 5%; Number of Terminations: 2; Series: RC; Lead Free: Lead Free; Reach SVHC Compliant: Unknown; RoHS Compliant: Yes
R11 = R22.1KΩ: SMD Chip Resistor, 22.1 kOhm, ï¿½ 1%, 100 mW, 0603 [1608 Metric], Thick Film, General Purpose; Manufacturer: Yageo; Manufacturer Part Number: RC0603FR-1322K1L; Power Rating: 100mW; Resistance: 22.1kR; Voltage Rating: 50V; Temperature Coefficient: 100ppm/°C; Supplier 1: Mouser; RoHS: Yes; Category: Chip SMD Resistors; Stock 1: 51738; Pricing 1: 1=0.1, 10=0.003, 50=0.003, 100=0.003, 1000=0.003, 10000=0.003 (USD); Case/Package: 0603; Case Code (Imperial): 0603; Case Code (Metric): 1608; Contact Plating: Tin,Matte; Min Operating Temperature: -55°C; Max Operating Temperature: 155°C; Packaging: Tape and Reel; Tolerance: 1%; Termination: SMD/SMT; Series: RC; Length: 1.6mm; Width: 0.8mm; Height: 0.45mm; Lead Free: Lead Free; RoHS Compliant: Yes
R12 = R47KΩ: SMD Chip Resistor, 47 kOhm, ï¿½ 1%, 100 mW, 0603 [1608 Metric], Thick Film, General Purpose; Manufacturer: Yageo; Manufacturer Part Number: RC0603FR-0747KL; Power Rating: 100mW; Voltage Rating: 50V; Resistance: 47kR; Temperature Coefficient: 100ppm/°C; Capacitance: 18pF; Supplier 1: Mouser; RoHS: Yes; Category: Chip SMD Resistors; Stock 1: 2022377; Pricing 1: 1=0.1, 10=0.007, 50=0.007, 100=0.007, 1000=0.006, 10000=0.002 (USD); Case/Package: 0603; Number of Pins: 2; Case Code (Metric): 1608; Case Code (Imperial): 0603; Size Code: 0603; Min Operating Temperature: -55°C; Max Operating Temperature: 155°C; Tolerance: 1%; Packaging: Tape and Reel; Voltage Rating (DC): 50V; Package Quantity: 1; Resistor Type: Thick Film; Number of Terminations: 2; Termination: SMD/SMT; Max Power Dissipation: 100mW; Features: Moisture Resistant; Series: RC; Resistance Tolerance: 1%; Technology: THICK FILM; Voltage Rating (AC): 50V; Length: 0.063inch; Width: 0.031inch; Height: 0.022inch; Depth: 0.8mm; Radiation Hardening: No; Lead Free: Lead Free; RoHS Compliant: Yes; Reach SVHC Compliant: Unknown
R13 = R4.7KΩ: Thick Film Resistors - SMD General Purpose Chip Resistor 0603, 4.7kOhms, 1%, 1/10W; Manufacturer Part Number: RC0603FR-074K7P; Manufacturer 1: Yageo Group; Max Power Dissipation: 100mW; Resistance: 4.7kΩ; Temperature Coefficient: 100ppm/°C; Working Voltage: 75V; Description 1: Res Thick Film 0603 4.7K Ohm 1% 0.1W(1/10W) ±100ppm/C Pad SMD T/R; Supplier 1: Mouser; Supplier Part Number 1: 603-RC0603FR-074K7P; RoHS: Compliant; Category: Chip SMD Resistors; Stock: 23538; Pricing: 1=0.1, 10=0.010, 50=0.010, 100=0.009, 1000=0.008, 10000=0.004 (USD); Case/Package: 0603; Case Code (Imperial): 0603; Case Code (Metric): 1608; China RoHS: Compliant; Composition: Thick Film; Country of Origin: Mainland China, Taiwan; Export Control Classification Number (ECCN) Code: EAR99; Features: Moisture Resistant; Height: 450µm; Harmonized Tariff Schedule (HTS) Code: 8533.21.00.30; Introduction Date: 2014-08-22; Length: 1.6002mm; Lifecycle Status: Production; Max Operating Temperature: 155°C; Min Operating Temperature: -55°C; Mount: Surface Mount; Number of Terminals: 2; Number of Terminations: 2; Power Dissipation: 100mW; REACH SVHC: Yes; Schedule B: 8533210045, 8533210045|8533210045|8533210045|8533210045|8533210045; Tolerance: 1%; Width: 800µm
R14 R15 = R18KΩ: Resistores de película gruesa - SMD General Purpose Chip Resistor 0603, 18kOhms, 5%, 1/10W; Manufacturer Part Number: RC0603JR-1018KL; Manufacturer 1: Yageo Group; Power Dissipation: 100mW; Temperature Coefficient: 100ppm/°C; Working Voltage: 75V; Description 1: Fixed Resistor, Metal Glaze/thick Film, 0.1W, 18000ohm, 75V, 5% +/-Tol, 100ppm/Cel, Surface Mount, 0603; Supplier 1: Mouser; Supplier Part Number 1: 603-RC0603JR-1018KL; RoHS: Compliant; Category: Chip SMD Resistors; Stock: 76843; Pricing: 1=0.1, 10=0.004, 50=0.004, 100=0.004, 1000=0.004, 10000=0.002 (USD); Case/Package: 0603; China RoHS: Non-Compliant; Composition: Thick Film; Contact Plating: Tin; Export Control Classification Number (ECCN) Code: EAR99; Height: 450µm; Harmonized Tariff Schedule (HTS) Code: 8533.21.00.30; Introduction Date: 2009-07-17; Lifecycle Status: Production; Max Operating Temperature: 155°C; Min Operating Temperature: -55°C; Mount: Surface Mount; Number of Terminals: 2; Packaging: Tape & Reel; Radiation Hardening: No; REACH SVHC: Yes; Resistance: 18kΩ; Tolerance: 5%; Width: 800µm; ComponentLink1URL: https://datasheet.octopart.com:443/RC0603JR-1018KL-Yageo-datasheet-175887523.pdf?src-supplier=IHS; ComponentLink1Description: https://datasheet.octopart.com:443/RC0603JR-1018KL-Yageo-datasheet-175887523.pdf?src-supplier=IHS; ComponentLink2URL: https://datasheet.octopart.com/RC0603JR-1018KL-Yageo-datasheet-73766026.pdf; ComponentLink2Description: https://datasheet.octopart.com/RC0603JR-1018KL-Yageo-datasheet-73766026.pdf; ComponentLink3URL: http://sigma.octopart.com:80/conflict_mineral_statement/Yageo-company-3.pdf?src-supplier=Compliance+Statements; ComponentLink3Description: http://sigma.octopart.com:80/conflict_mineral_statement/Yageo-company-3.pdf?src-supplier=Compliance+Statements; ComponentLink4URL: http://sigma.octopart.com:80/rohs_statement/Yageo-company-2.pdf?src-supplier=Compliance+Statements; ComponentLink4Description: http://sigma.octopart.com:80/rohs_statement/Yageo-company-2.pdf?src-supplier=Compliance+Statements
SW4 = SS12D00: pin to pad: COM>2 NC>1 NO>3; Manufacturer: CTS; Manufacturer Part Number: 219-3MST; Mechanical Life: 2000Cycles; Throw Configuration: SPST; Voltage Rating (DC): 20V; Number of Positions: 3; Actuator Type: Slide (Standard); Current Rating: 100mA; Washable: Yes; Supplier 1: Mouser; RoHS: Yes; Category: DIP Switches; Stock 1: 6563; Pricing 1: 1=0.68, 10=0.509, 50=0.509, 100=0.509, 1000=0.41, 10000=0.359 (USD); Mount: Surface Mount; Contact Material: Copper; Contact Plating: Gold,Tin; Min Operating Temperature: -55°C; Max Operating Temperature: 85°C; Packaging: Rail/Tube; Max Voltage Rating (DC): 20V; Electrical Life: 2000Cycles; Series: 219; Termination: Gull Wing; Package Quantity: 60; Max Current Rating: 100mA; Orientation: Straight; Length: 9.09mm; Terminal Pitch: 2.54mm; Depth: 9.91mm; Radiation Hardening: No; RoHS Compliant: Yes; Lead Free: Lead Free; Supplier 2: Mouser; Stock 2: 6563; Pricing 2: 1=0.68, 10=0.509, 50=0.509, 100=0.509, 1000=0.41, 10000=0.359 (USD)
U2 = LMR50410YQDBVRQ1: Automotive qualified SIMPLE SWITCHER 4-V to 36-V, 1-A synchronous step-down converter 6-SOT-23 -40 to 150; Manufacturer: Texas Instruments; Supplier 1: Mouser; Manufacturer Part Number: LMR50410YQDBVRQ1; RoHS: Yes; Category: Voltage Regulators - Switching; Stock 1: 16266; Pricing 1: 1=1.44, 10=0.951, 50=0.951, 100=0.793, 1000=0.738, 10000=0.714 (USD)
U3 U4 = DRV8871DDA: Brushed DC Motor Driver With PWM Control 6.5V to 45V 8-Pin SOPowerPAD T/R; pin to pad: 7>7+9; Manufacturer: Texas Instruments; Manufacturer Lifecycle Status: ACTIVE; Manufacturer Part Number: DRV8872DDAR; Output Current: 3.6A; Fault Protection: Over Temperature; Description 2: 50-V, 3.6-A H-bridge motor driver with integrated current sensing 8-SO PowerPAD -40 to 125; Supplier 1: Mouser; RoHS: Yes; Category: Motor Drivers; Stock 1: 25767; Pricing 1: 1=2.13, 10=1.44, 50=1.44, 100=1.29, 1000=1.09, 10000=0.983 (USD); Mount: Surface Mount; Min Operating Temperature: -40°C; Max Operating Temperature: 125°C; Series: -; Packaging: Cut Tape; Interface: PWM; Operating Supply Voltage: 45V; Technology: NMOS; RoHS Compliant: Yes; Lead Free: Lead Free; Supplier 2: Mouser; Supplier Part Number 2: 595-DRV8871DDAR; Stock: 2652; Pricing: 1=2.73, 10=2.04, 50=1.86, 100=1.67, 1000=1.48, 10000=1.4 (USD); Height: 1.7mm; Length: 4.89mm; Lifecycle Status: Production; Max Output Current: 3.6A; Schedule B: 8542390000, 8542390000|8542390000|8542390000|8542390000|8542390000; Thickness: 1.48mm; Width: 3.9mm; ComponentLink1URL: https://sigma.octopart.com:443/104526336/technical_drawing/Texas-Instruments-DRV8871DDAR.pdf?src-supplier=Texas+Instruments; ComponentLink1Description: https://sigma.octopart.com:443/104526336/technical_drawing/Texas-Instruments-DRV8871DDAR.pdf?src-supplier=Texas+Instruments; ComponentLink2URL: https://octopart.com:443/opatz8j6/c1?t=eovAouxq1ql5NErN5noCIYtz9tWJrXcwJH4IBEA3OpyBNCbX9ft7yopw4ue9x_XAPThjFx7YREnroSUWrHImAajCyiwiaQxklctOD_iyhqUObfCdktjK-RCCnQmDAUGJ3cBfkab-OZlx3ML2okEgysUwe4wzBcr3zRuKZfAglX7wJFbNxSlY0EWkLukCwQAdRfImK5LRiohywoR99RCT8i75kwwqbmaBx4SOvJyF_UZCBvcx-Wai0_-9bLbkHs9dcWhJXjgl9Z51ewMipxS1kltstwmSaap52YtCPluIPaUa74crir1nqgGhL86_jkS4ibHX8gBeP6Zs2j_tFgM4BX6aTawvX3NdaGwAs6-jOXUDwTMkKNPVyxMrIsFWDn39AjdJCl4&src-supplier=Texas+Instruments; ComponentLink2Description: https://octopart.com:443/opatz8j6/c1?t=eovAouxq1ql5NErN5noCIYtz9tWJrXcwJH4IBEA3OpyBNCbX9ft7yopw4ue9x_XAPThjFx7YREnroSUWrHImAajCyiwiaQxklctOD_iyhqUObfCdktjK-RCCnQmDAUGJ3cBfkab-OZlx3ML2okEgysUwe4wzBcr3zRuKZfAglX7wJFbNxSlY0EWkLukCwQAdRfImK5LRiohywoR99RCT8i75kwwqbmaBx4SOvJyF_UZCBvcx-Wai0_-9bLbkHs9dcWhJXjgl9Z51ewMipxS1kltstwmSaap52YtCPluIPaUa74crir1nqgGhL86_jkS4ibHX8gBeP6Zs2j_tFgM4BX6aTawvX3NdaGwAs6-jOXUDwTMkKNPVyxMrIsFWDn39AjdJCl4&src-supplier=Texas+Instruments; ComponentLink3URL: https://datasheet.octopart.com:443/DRV8871DDAR-Texas-Instruments-datasheet-45082942.pdf?src-supplier=Texas+Instruments; ComponentLink3Description: https://datasheet.octopart.com:443/DRV8871DDAR-Texas-Instruments-datasheet-45082942.pdf?src-supplier=Texas+Instruments; ComponentLink4URL: https://sigma.octopart.com:443/49250132/technical_drawing/Texas-Instruments-DRV8871DDAR.pdf?src-supplier=Texas+Instruments; ComponentLink4Description: https://sigma.octopart.com:443/49250132/technical_drawing/Texas-Instruments-DRV8871DDAR.pdf?src-supplier=Texas+Instruments; ComponentLink5URL: https://datasheet.octopart.com:443/DRV8871DDAR-Texas-Instruments-datasheet-164414318.pdf?src-supplier=SHENGYU+ELECTRONICS; ComponentLink5Description: https://datasheet.octopart.com:443/DRV8871DDAR-Texas-Instruments-datasheet-164414318.pdf?src-supplier=SHENGYU+ELECTRONICS; ComponentLink6URL: http://sigma.octopart.com:80/reach_statement/Texas-Instruments-company-64.pdf?src-supplier=Compliance+Statements; ComponentLink6Description: http://sigma.octopart.com:80/reach_statement/Texas-Instruments-company-64.pdf?src-supplier=Compliance+Statements; ComponentLink7URL: http://sigma.octopart.com:80/conflict_mineral_statement/Texas-Instruments-company-63.pdf?src-supplier=Compliance+Statements; ComponentLink7Description: http://sigma.octopart.com:80/conflict_mineral_statement/Texas-Instruments-company-63.pdf?src-supplier=Compliance+Statements; Manufacturer 2: Texas Instruments; Number of Pins: 8

## Nets that join several sheets
5V_SYS: LOGIC (11 pins), POWER (6 pins)
GND: LOGIC (19 pins), POWER (31 pins)
VCC: LOGIC (6 pins), POWER (JP3.A Q2.D)
VUSB: LOGIC (J8.5V), POWER (D?.2 Q?.G R?.1)